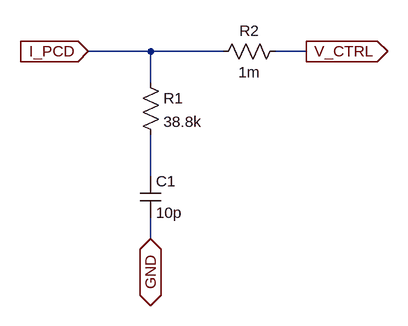
[diagram p0: schematic f_l.asc]
f_l.asc, the LTspice schematic file:
Version 4
SHEET 1 880 680
WIRE 96 64 0 64
WIRE 208 64 96 64
WIRE 336 64 288 64
WIRE 96 112 96 64
WIRE 96 256 96 192
WIRE 96 352 96 320
FLAG 0 64 I_PCD
IOPIN 0 64 In
FLAG 336 64 V_CTRL
IOPIN 336 64 Out
FLAG 96 352 GND
IOPIN 96 352 BiDir
SYMBOL res 80 96 R0
SYMATTR InstName R1
SYMATTR Value 38.8k
SYMBOL res 304 48 R90
WINDOW 0 0 56 VBottom 2
WINDOW 3 32 56 VTop 2
SYMATTR InstName R2
SYMATTR Value 1m
SYMBOL cap 80 256 R0
SYMATTR InstName C1
SYMATTR Value 10p

The netlist it stands for:
* f_l.asc
R1 I_PCD N001 38.8k
R2 V_CTRL I_PCD 1m
C1 N001 GND 10p
.backanno
.end